# EAGLE design v1 (EAGLE 6.1)
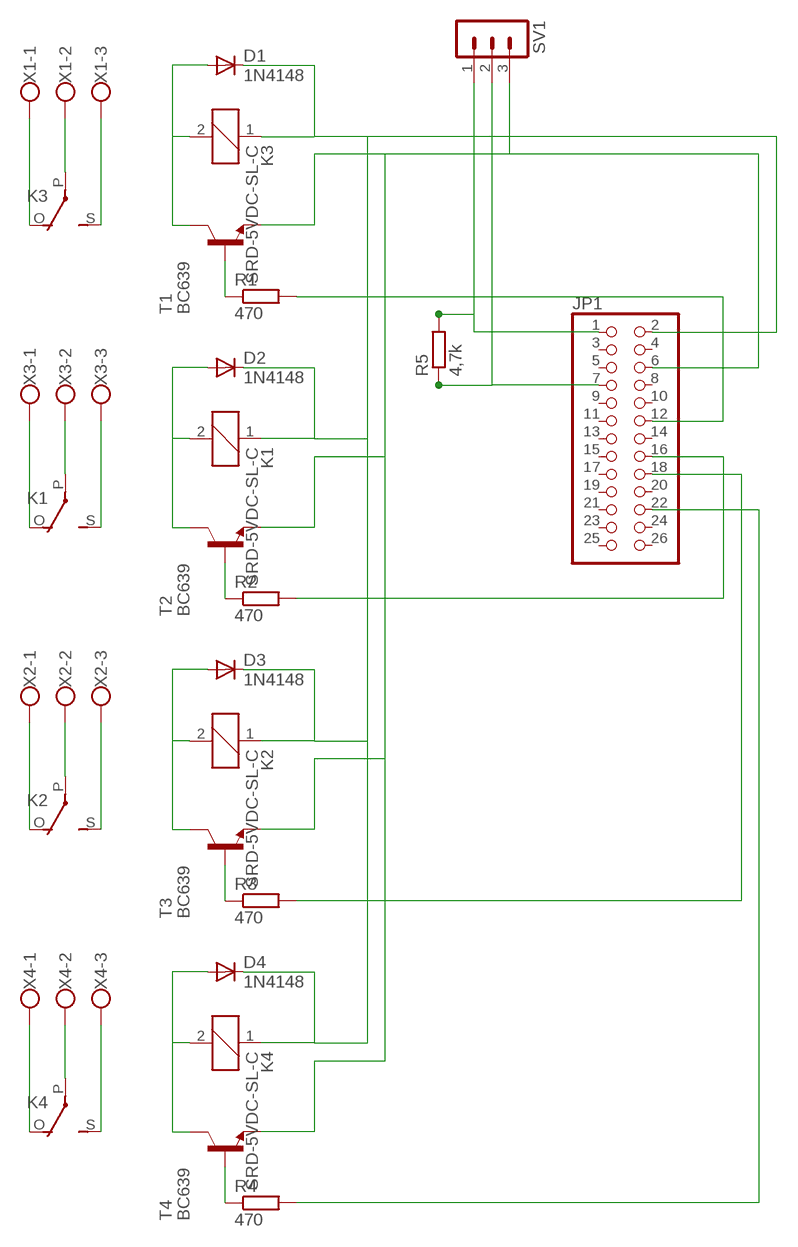
[diagram p0: schematic, sheet 1]

## Parts
D1  1N4148  1N4004  [DO41-10]
D2  1N4148  1N4004  [DO41-10]
D3  1N4148  1N4004  [DO41-10]
D4  1N4148  1N4004  [DO41-10]
JP1  PINHD-2X13  [2X13]
K1  SRD-5VDC-SL-C  ZF112  [ZF112]
K2  SRD-5VDC-SL-C  ZF112  [ZF112]
K3  SRD-5VDC-SL-C  ZF112  [ZF112]
K4  SRD-5VDC-SL-C  ZF112  [ZF112]
R1  470  R-EU_0204/7  [0204/7]
R2  470  R-EU_0204/7  [0204/7]
R3  470  R-EU_0204/7  [0204/7]
R4  470  R-EU_0204/7  [0204/7]
R5  4,7k  R-EU_0207/7  [0207/7]
SV1  MA03-1  [MA03-1]
T1  BC639  BC639-NPN-TO92-ECB  [TO92-ECB]
T2  BC639  BC639-NPN-TO92-ECB  [TO92-ECB]
T3  BC639  BC639-NPN-TO92-ECB  [TO92-ECB]
T4  BC639  BC639-NPN-TO92-ECB  [TO92-ECB]
X1  W237-103  [W237-103]
X2  W237-103  [W237-103]
X3  W237-103  [W237-103]
X4  W237-103  [W237-103]

## Nets
N$1: JP1.12 R1.2
N$2: D1.A K3.2 T1.C
N$3: JP1.16 R2.2
N$4: JP1.6 SV1.3 T1.E T2.E T3.E T4.E
N$5: R1.1 T1.B
N$6: K3.P(2:P) X1.2
N$7: K3.S(2:S) X1.3
N$8: K3.O(2:O) X1.1
N$9: D1.C D2.C D3.C D4.C JP1.2 K1.1 K2.1 K3.1 K4.1
N$10: D2.A K1.2 T2.C
N$11: JP1.1 R5.2 SV1.1
N$12: R2.1 T2.B
N$13: D3.A K2.2 T3.C
N$14: K1.P(2:P) X3.2
N$15: K1.S(2:S) X3.3
N$16: K1.O(2:O) X3.1
N$17: R3.1 T3.B
N$18: JP1.7 R5.1 SV1.2
N$19: K2.P(2:P) X2.2
N$20: K2.S(2:S) X2.3
N$21: K2.O(2:O) X2.1
N$23: JP1.18 R3.2
N$25: D4.A K4.2 T4.C
N$26: R4.1 T4.B
N$28: K4.P(2:P) X4.2
N$29: K4.S(2:S) X4.3
N$31: K4.O(2:O) X4.1
N$32: JP1.22 R4.2
Unconnected: JP1.3 JP1.4 JP1.5 JP1.8 JP1.9 JP1.10 JP1.11 JP1.13 JP1.14 JP1.15 JP1.17 JP1.19 JP1.20 JP1.21 JP1.23 JP1.24 JP1.25 JP1.26

## Library data of the parts
D1-D4 = diode:1N4004: DIODE general purpose rectifier, 1 A
JP1 = pinhead:PINHD-2X13: PIN HEADER
K1-K4 = relay:ZF112: RELAY 1 x switch; OC_FARNELL: unknown; OC_NEWARK: unknown
R1-R5 = rcl:R-EU_: RESISTOR, European symbol
SV1 = con-lstb:MA03-1: PIN HEADER; OC_FARNELL: unknown; OC_NEWARK: unknown
T1-T4 = transistor:*-NPN-: NPN Transistror BF959 corrected 2008.03.06
X1-X4 = con-wago-500:W237-103: WAGO SCREW CLAMP; MPN: 237-103; OC_FARNELL: unknown; OC_NEWARK: 18M7116

## Board
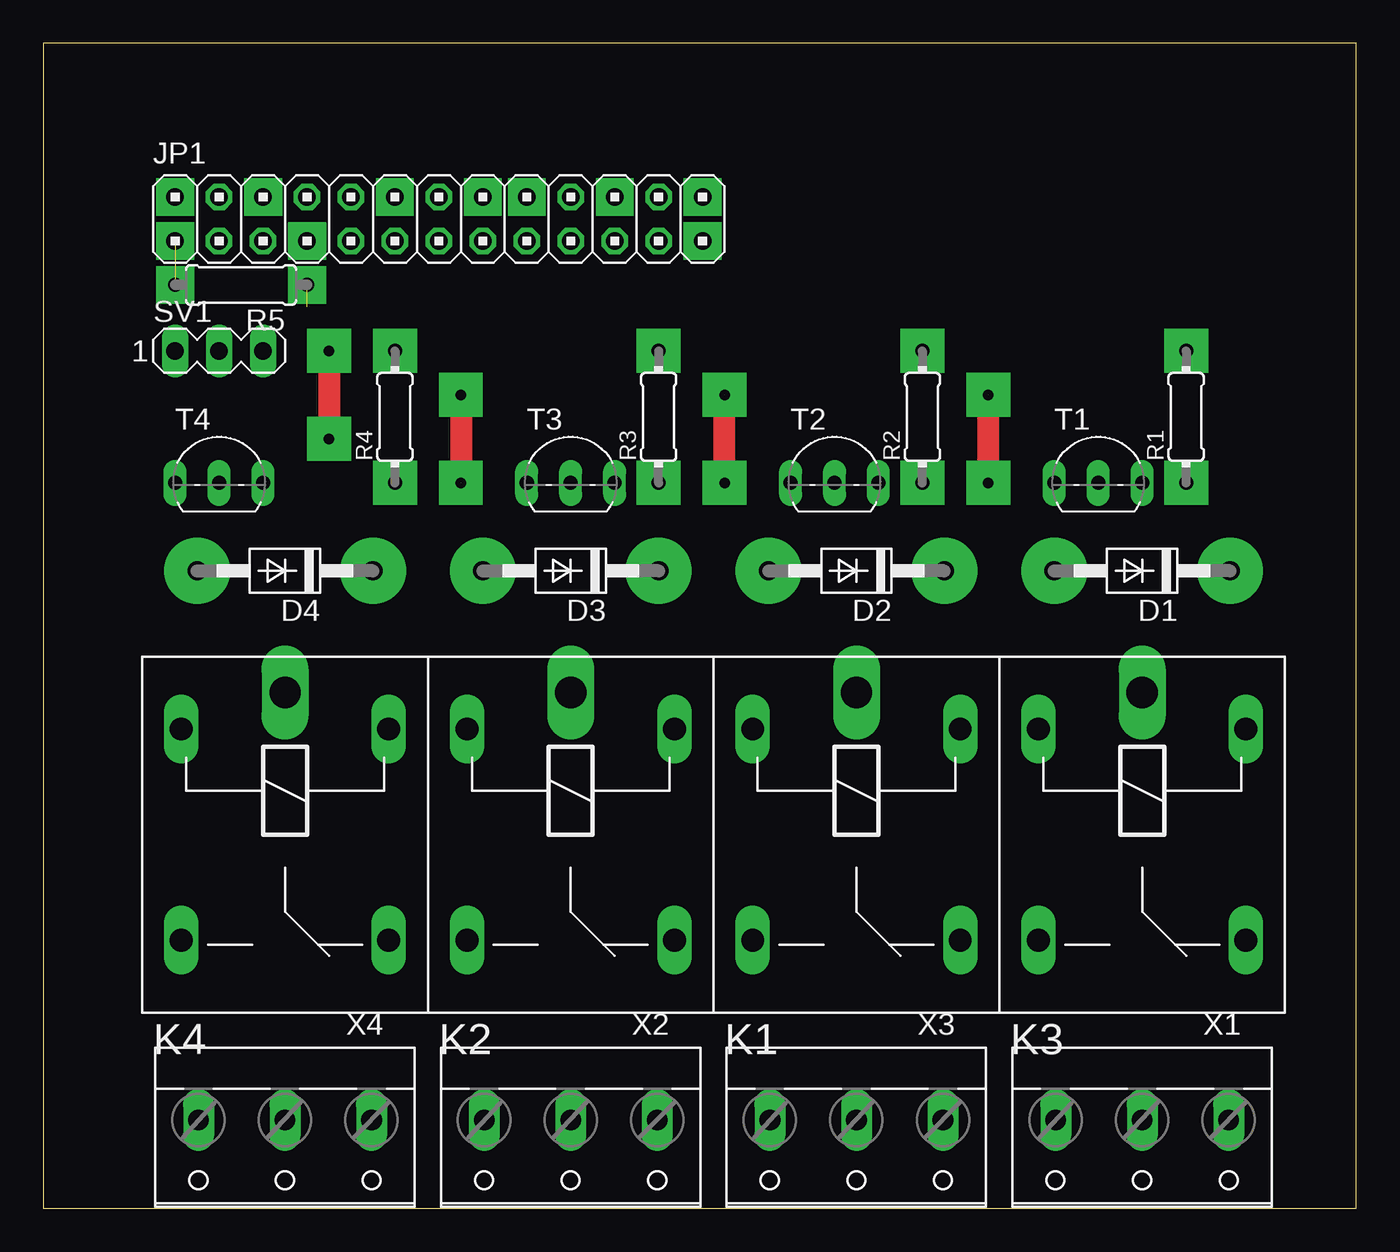
[diagram p1: board, top side]
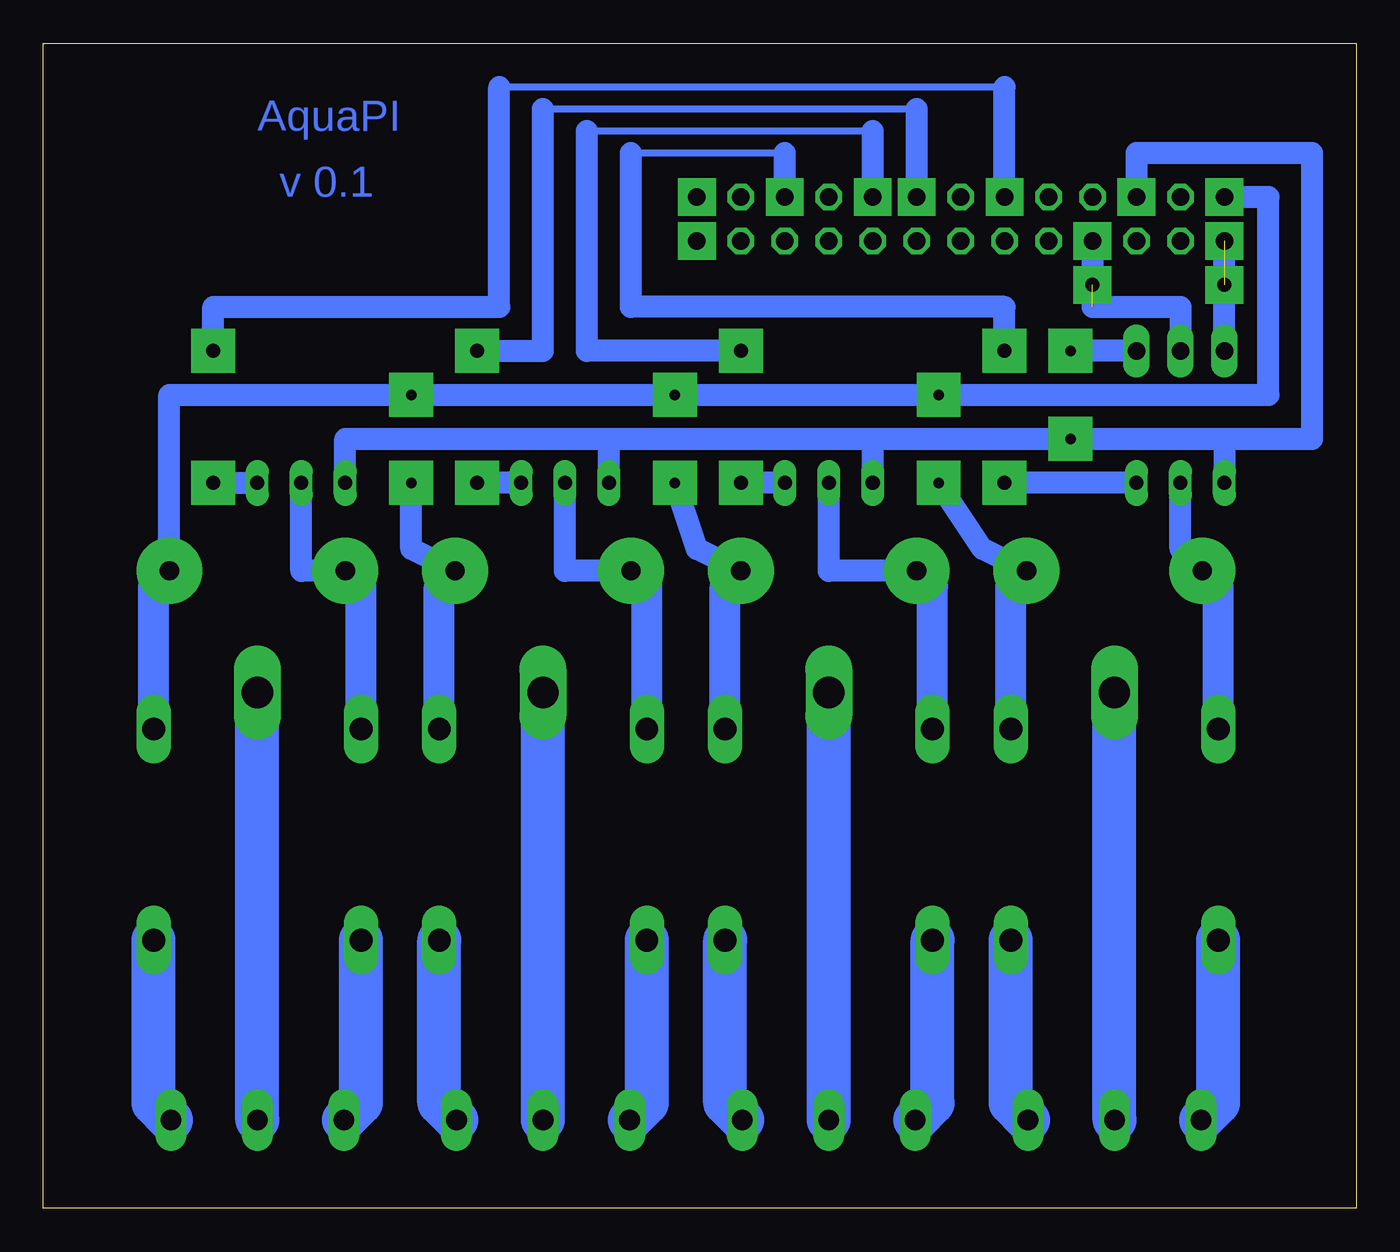
[diagram p2: board, bottom side, seen from below]

Size 75.87 x 67.3 mm. Coordinates in mm from the lower left corner, seen from the top.
Outline: 0,0 75.87,0 75.87,67.3 0,67.3 0,0
Copper layers (1*16): Top 0.035mm / dielectric 1.5mm / Bottom 0.035mm
Design rules: minimum track width 10mil, minimum drill 24mil, track to track 8mil, track to pad 8mil, pad to pad 8mil, via to via 8mil, smd to smd 8mil, copper to edge 40mil, drill to drill 8mil, minimum pad ring 10mil, minimum via ring 8mil, stop-mask expansion 4mil, vias tented up to drill 0mil, thermal gap 10mil

### Footprints (pad centres in the part's own frame; a part is rotated, then mirrored left to right if it is on the bottom)
DO41-10 = drill 1.118: A 5.08,0; C -5.08,0
2X13 = drill 1.016 octagon: 1 -15.24,-1.27; 2 -15.24,1.27; 3 -12.7,-1.27; 4 -12.7,1.27; 5 -10.16,-1.27; 6 -10.16,1.27; 7 -7.62,-1.27; 8 -7.62,1.27; 9 -5.08,-1.27; 10 -5.08,1.27; 11 -2.54,-1.27; 12 -2.54,1.27; 13 0,-1.27; 14 0,1.27; 15 2.54,-1.27; 16 2.54,1.27; 17 5.08,-1.27; 18 5.08,1.27; 19 7.62,-1.27; 20 7.62,1.27; 21 10.16,-1.27; 22 10.16,1.27; 23 12.7,-1.27; 24 12.7,1.27; 25 15.24,-1.27; 26 15.24,1.27
ZF112 = drill 1.321 long: 1 -6.096,5.994; 2 -6.096,-5.994; O 6.096,5.994; S 6.096,-5.994 | drill 1.803 long: P -8.204,0
0204/7 = drill 0.813 octagon: 1 -3.81,0; 2 3.81,0
0207/7 = drill 0.813 octagon: 1 -3.81,0; 2 3.81,0
MA03-1 = drill 1.016 long: 1 -2.54,0; 2 0,0; 3 2.54,0
TO92-ECB = drill 0.813 long: B 2.54,0; C 0,0; E -2.54,0
W237-103 = drill 1.194 long: 1 -5,-1.29; 2 0,-1.29; 3 5,-1.29

### Placement (x,y rotation side)
D1  63.5,36.83 180 top
D2  46.99,36.83 180 top
D3  30.48,36.83 180 top
D4  13.97,36.83 180 top
JP1  22.86,57.15 0 top
K1  46.99,21.59 270 top
K2  30.48,21.59 270 top
K3  63.5,21.59 270 top
K4  13.97,21.59 270 top
R1  66.04,45.72 90 top
R2  50.8,45.72 90 top
R3  35.56,45.72 90 top
R4  20.32,45.72 90 top
R5  11.43,53.34 180 top
SV1  10.16,49.53 0 top
T1  60.96,41.91 0 top
T2  45.72,41.91 0 top
T3  30.48,41.91 0 top
T4  10.16,41.91 0 top
X1  63.5,3.81 180 top
X2  30.48,3.81 180 top
X3  46.99,3.81 180 top
X4  13.97,3.81 180 top

### Tracks (layer width: path | path; a pad name or v marks a point on that pad's centre or on a via)
N$1
  Bottom 0.406: 20.32,64.77 49.53,64.77
  Bottom 1.27: R1.2 66.04,52.07 49.53,52.07 49.53,64.77 | JP1.12 20.32,64.77
N$2
  Bottom 1.27: D1.A 60.96,36.83 T1.C
  Bottom 1.778: K3.2 57.51,35.92 D1.A
N$3
  Bottom 0.406: 25.4,63.5 46.99,63.5
  Bottom 1.27: R2.2 46.99,49.53 46.99,63.5 | JP1.16 25.4,63.5
N$4  (via drill 0.6 pad 2.54)
  Top 1.27: v16.51,49.53 v16.51,44.45
  Bottom 1.27: T1.E 58.42,44.45 43.18,44.45 | T2.E 43.18,44.45 | 43.18,44.45 27.94,44.45 | T3.E 27.94,44.45 | 27.94,44.45 v16.51,44.45 7.62,44.45 | 7.62,44.45 T4.E | 7.62,44.45 2.54,44.45 2.54,60.96 12.7,60.96 JP1.6 | SV1.3 v16.51,49.53
N$5
  Bottom 1.27: R1.1 T1.B
N$6
  Bottom 2.54: X1.2 K3.P
N$7
  Bottom 2.54: X1.3 57.51,6.09 K3.S
N$8
  Bottom 2.54: X1.1 69.49,6.09 K3.O
N$9  (via drill 0.6 pad 2.54)  (3 unrouted)
  Top 1.27: v54.61,41.91 v54.61,46.99 | v39.37,41.91 v39.37,46.99 | v24.13,46.99 v24.13,41.91
  Bottom 1.27: D2.C 54.61,38.1 v54.61,41.91 | D3.C 38.1,38.1 v39.37,41.91 | D1.C 68.58,46.99 v54.61,46.99 v39.37,46.99 v24.13,46.99 5.08,46.99 5.08,58.42 JP1.2 | D4.C 21.59,38.1 v24.13,41.91
  Bottom 1.778: K3.1 69.49,35.92 D1.C | K1.1 52.98,35.92 D2.C | K2.1 36.47,35.92 D3.C | K4.1 19.96,35.92 D4.C
N$10
  Bottom 1.27: D2.A 45.72,36.83 T2.C
  Bottom 1.778: K1.2 41,35.92 D2.A
N$11  (1 unrouted)
  Bottom 1.27: SV1.1 JP1.1
N$12
  Bottom 1.27: T2.B R2.1
N$13
  Bottom 1.27: D3.A 30.48,36.83 T3.C
  Bottom 1.778: K2.2 24.49,35.92 D3.A
N$14
  Bottom 2.54: X3.2 K1.P
N$15
  Bottom 2.54: X3.3 41,6.09 K1.S
N$16
  Bottom 2.54: X3.1 52.98,6.09 K1.O
N$17
  Bottom 1.27: T3.B R3.1
N$18  (1 unrouted)
  Bottom 1.27: JP1.7 15.24,52.07 10.16,52.07 SV1.2
N$19
  Bottom 2.54: X2.2 K2.P
N$20
  Bottom 2.54: X2.3 24.49,6.09 K2.S
N$21
  Bottom 2.54: X2.1 36.47,6.09 K2.O
N$22  (via drill 0.7 pad 2.54)
  other vias: 20.32,49.53
N$23
  Bottom 0.406: 27.94,62.23 44.45,62.23
  Bottom 1.27: R3.2 44.45,49.53 44.45,62.23 | JP1.18 27.94,62.23
N$24  (via drill 0.7 pad 2.54)
  other vias: 20.32,41.91
N$25
  Bottom 1.27: D4.A 10.16,38.1 T4.C
  Bottom 1.778: K4.2 7.98,35.92 D4.A
N$26
  Bottom 1.27: T4.B R4.1
N$27  (via drill 0.7 pad 2.54)
  other vias: 50.8,49.53
N$28
  Bottom 2.54: X4.2 K4.P
N$29
  Bottom 2.54: X4.3 7.98,6.09 K4.S
N$30  (via drill 0.7 pad 2.54)
  other vias: 35.56,49.53
N$31
  Bottom 2.54: X4.1 19.96,6.09 K4.O
N$32
  Bottom 0.406: 33.02,60.96 41.91,60.96
  Bottom 1.27: R4.2 20.32,52.07 41.91,52.07 41.91,60.96 | JP1.22 33.02,60.96
N$33  (via drill 0.7 pad 2.54)
  other vias: 35.56,41.91
N$34  (via drill 0.7 pad 2.54)
  other vias: 66.04,49.53
N$35  (via drill 0.7 pad 2.54)
  other vias: 66.04,41.91
N$36  (via drill 0.7 pad 2.54)
  other vias: 50.8,41.91
N$39  (via drill 0.7 pad 3.81)
  other vias: 8.89,36.83
N$40  (via drill 0.7 pad 3.81)
  other vias: 19.05,36.83
N$41  (via drill 0.7 pad 3.81)
  other vias: 35.56,36.83
N$42  (via drill 0.7 pad 3.81)
  other vias: 25.4,36.83
N$43  (via drill 0.7 pad 3.81)
  other vias: 52.07,36.83
N$44  (via drill 0.7 pad 3.81)
  other vias: 41.91,36.83
N$45  (via drill 0.7 pad 3.81)
  other vias: 68.58,36.83
N$46  (via drill 0.7 pad 3.81)
  other vias: 58.42,36.83
N$47  (via drill 0.7 pad 2.18)
  other vias: 7.62,58.42
N$48  (via drill 0.7 pad 2.18)
  other vias: 15.24,55.88
N$49  (via drill 0.7 pad 2.18)
  other vias: 15.24,53.34
N$50  (via drill 0.7 pad 2.18)
  other vias: 27.94,58.42
N$51  (via drill 0.7 pad 2.18)
  other vias: 33.02,58.42
N$52  (via drill 0.7 pad 2.18)
  other vias: 25.4,58.42
N$53  (via drill 0.7 pad 2.18)
  other vias: 12.7,58.42
N$54  (via drill 0.7 pad 2.18)
  other vias: 7.62,55.88
N$55  (via drill 0.7 pad 2.18)
  other vias: 7.62,53.34
N$56  (via drill 0.7 pad 2.18)
  other vias: 20.32,58.42
N$57  (via drill 0.7 pad 2.18)
  other vias: 38.1,58.42
N$58  (via drill 0.7 pad 2.18)
  other vias: 38.1,55.88

### Text on the board
Bottom: AquaPI | v 0.1